# Altium schematic sheet Thermokoppel.SchDoc
size A4; SheetNumber: 1; SheetTotal: 5
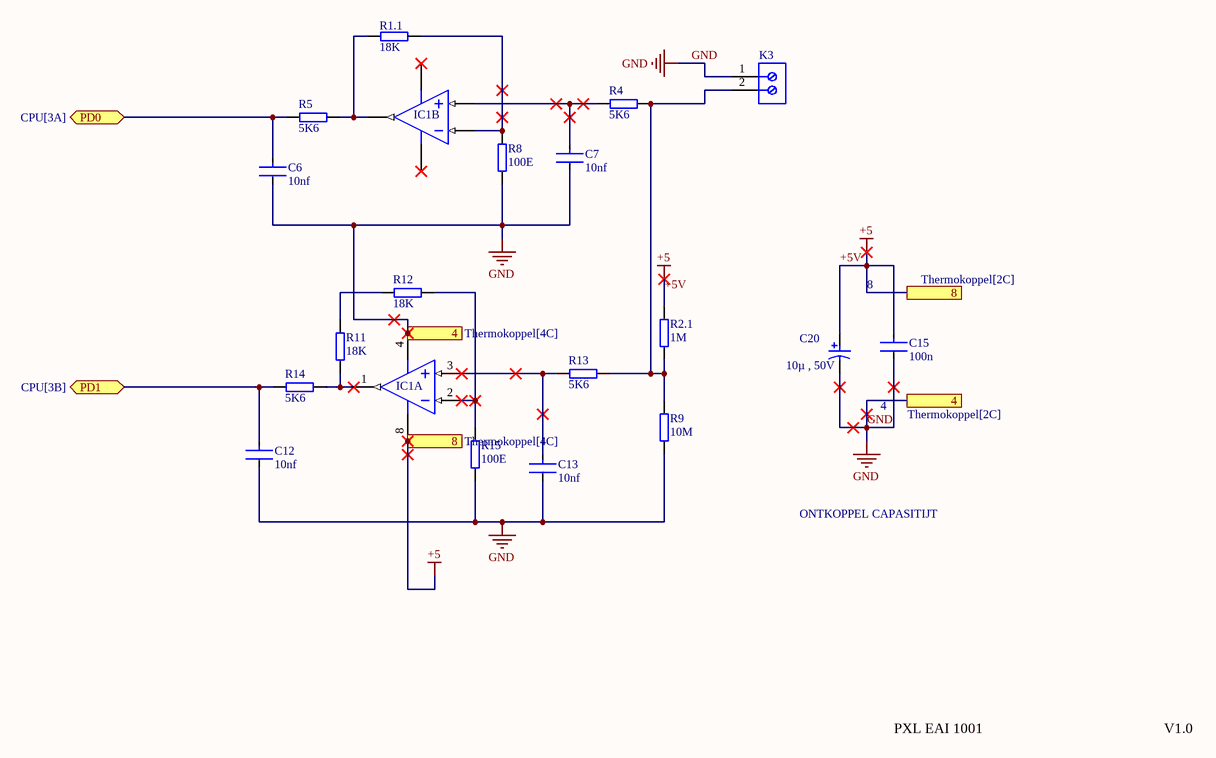
[diagram p0: Thermokoppel.SchDoc]

## Parts
C6  10nf  [CC_0805_L]
C7  10nf  [CC_0805_L]
C12  10nf  [CC_0805_L]
C13  10nf  [CC_0805_L]
C15  100n  [CC_0805_L]
C20  10µ , 50V  [CE_D8_L10]
IC1  Dual_Opamp  [MSOP_8_M]  (value not drawn)  (parts A,B of 2)
K3  282836-2  [terminal_block]  (value not drawn)
R1.1  18K  [R_0805_M]
R2.1  1M  [R_0805_M]
R4  5K6  [R_0805_M]
R5  5K6  [R_0805_M]
R8  100E  [R_0805_M]
R9  10M  [R_0805_M]
R11  18K  [R_0805_M]
R12  18K  [R_0805_M]
R13  5K6  [R_0805_M]
R14  5K6  [R_0805_M]
R15  100E  [R_0805_M]

## Ports
4 (see Thermokoppel[2C]), 4 (see Thermokoppel[4C]), 8 (see Thermokoppel[2C]), 8 (see Thermokoppel[4C]), PD0 (bidir, see CPU[3A]), PD1 (bidir, see CPU[3B])

## Nets
+5V: C15.1 C20.2 IC1.8(VDD) R2.1.2 ; port 8  [also labelled +5]
GND: C6.2 C7.2 C12.2 C13.2 C15.2 C20.1 IC1.4(VSS) K3.1 R8.1 R9.1 R15.1 ; port 4
PD0: C6.1 R5.1 ; port PD0
PD1: C12.1 R14.1 ; port PD1
NetC7_1: C7.1 IC1.5(VINB+) R4.1
NetC13_1: C13.1 IC1.3(VINA+) R13.1
NetIC1_1: IC1.1(VOUTA) R11.1 R14.2
NetIC1_2: IC1.2(VINA-) R12.2 R15.2
NetIC1_6: IC1.6(VINB-) R1.1.2 R8.2
NetIC1_7: IC1.7(VOUTB) R1.1.1 R5.2
NetK3_2: K3.2 R2.1.1 R4.2 R9.2 R13.2
NetR11_2: R11.2 R12.1

## Notes on the sheet
- 8
- 4
- ONTKOPPEL CAPASITIJT
- PXL EAI 1001
- V1.0

## Library data of the parts
C6 C7 C12 C13 C15 = Capacitor_Ceramic: Manufacturer: KEMET; Manufacturer Part Number: C0805C224K5RACTU; Value: 0.22 μF; Temperature Characteristic: X7R; Temperature Coefficient: 30ppm/°C; Tolerance: 0.1; Voltage Rating: 50 V; ComponentLink2URL: https://content.kemet.com/datasheets/KEM_C1003_C0G_SMD.pdf; Device Class L3: Ceramic Capacitors; Lead Free: Yes; Temperature: -55°C to +125°C; RoHS: TRUE; Capacitance: 0.22 μF; Automotive: No; Material: Ceramic; Octopart: https://octopart.com/c0805c224k5ractu-kemet-144670; Temperature Range Low: -55°C; Height: 0.88mm; Device Class L1: Passive Components; Digikey Description: CAP CER 0.22UF 50V X7R 0805; ComponentLink2Description: Datasheet; Mouser Description: CAP CER 0.22UF 50V X7R 0805; Category: Cap; Ipc Land Pattern Name: CAPC200125X78; Temperature Range High: +125°C; Package: C0805C-DN; Device Class L2: Capacitors
C20 = Capacitor_Electrolytic: Manufacturer: Panasonic; Voltage Rating: 25 V; ComponentLink2URL: http://industrial.panasonic.com/cdbs/www-data/pdf/RDE0000/ABA0000C1181.pdf; Height: 10.2 mm; Max Operating Temperature: 105 degC; PackageReference: EEE-FK1E221P; ComponentLink1Description: Manufacturer URL; ComponentLink1URL: http://www.panasonic.com/; Mount: Surface Mount; REACH SVHC: No SVHC; Min Operating Temperature: -55 degC; ComponentLink2Description: Datasheet; DatasheetVersion: 03/2016; Length: 10.2 mm; RoHSCompliant: true; Packaging: Tape and Reel; Package Quantity: 500; Lead Pitch: 3.1 mm; Pins: 2; PackageDescription: 2-Pin Electrolytic Aluminum Capacitor, Body 8.3 x 8.3 mm; Mounting Technology: Surface Mount
IC1 = Dual_Opamp: Slew Rate: 0.6V/µs; Supply Current: 100uA; Power Supply Rejection Ratio (PSRR): 86dB; Input Offset Voltage (Vos): 4.5mV; Input Bias Current: 1pA; Amplifier Type: GENERAL PURPOSE; Unity Gain Bandwidth Product: 1MHz; Number of Circuits: 2; Output Current: 23mA; Operating Supply Voltage: 5.5V; Min Supply Voltage: 1.8V; Common Mode Rejection Ratio: 60dB; Voltage Gain: 112dB; Max Supply Voltage: 6V; Package Quantity: 60; REACH SVHC: No SVHC; Min Operating Temperature: -40°C; Max Operating Temperature: 125°C; Mount: Through Hole; Nominal Supply Current: 100uA; Height: 3.3mm; Length: 9.27mm; Slew Rate-Nom: 0.6V/µs; Packaging: Rail/Tube; Output Current per Channel: 23mA; Number of Amplifiers: 2; RoHS Compliant: Yes; Radiation Hardening: No; Bandwidth: 1MHz; Lead Free: Lead Free; Width: 6.35mm; Number of Channels: 2; Gain Bandwidth Product: 1MHz; Technology: CMOS; Operating Supply Current: 100uA; Number of Elements: 2; Number of Pins: 8; Input Offset Voltage-Max: 4.5mV; Case/Package: PDIP
K3 = 1x2 terminal block: Female Header, Pitch 5 mm, 1 x 2 Position, Height 10 mm, Tail Length 3.5 mm, Rohs, Bulk; Manufacturer: TE Connectivity; Wire Gauge: 16-30AWG; Product Training Modules: Wire-to-BoardEurostyleTerminalBlocks; Clamp Material - Plating: Brass-NickelPlated; Voltage: 300V; Mating Orientation: HorizontalwithBoard; Current: 13.5A; Pitch: 0.197"(5.00mm); Screw Thread: M3; 3D Model: 282836-2.pdf; Other Names: 5ULV-02B / A98076; Dynamic Catalog: BuchananSeries; Number of Levels: 1; Torque - Screw: 0.68Nm(6Lb-In); Featured Product: EurostyleTerminalBlockConnectors; Positions Per Level: 2; Wire Termination: Screw-RisingCageClamp; Datasheet URL: http://www.te.com.cn/commerce/DocumentDelivery/DDEController?Action=showdoc&DocId=Catalog+Section%7F1308389_EUROSTYLE_TERMINAL_BLOCKS%7F0607%7Fpdf%7FEnglish%7FENG_CS_1308389_EUROSTYLE_TERMINAL_BLOCKS_0607.pdf%7F282836-2; Color: Green; Family: TerminalBlocks-WiretoBoard; RoHS Information: 282836-2StatementofCompliance; Standard Package: 300; Contact Material - Plating: Brass-TinPlated; Manufacturer URL: http://www.te.com; Housing Material: Polyamide(PA66),Nylon6/6; Features: Interlocking(Side); Package Description: Female Header, Pitch 5 mm, 1 x 2 Position, Height 10 mm, Tail Length 3.5 mm; Mounting Type: ThroughHole; Package Reference: THD; Packaging: Bulk; Series: Buchanan; Category: Connectors,Interconnects; Screw Material - Plating: Brass-NickelPlated
R1.1 R2.1 R4 R5 R8 R9 R11-R15 = Resistor: Manufacturer: Vishay Dale; Part Number: CRCW08050000Z0EA